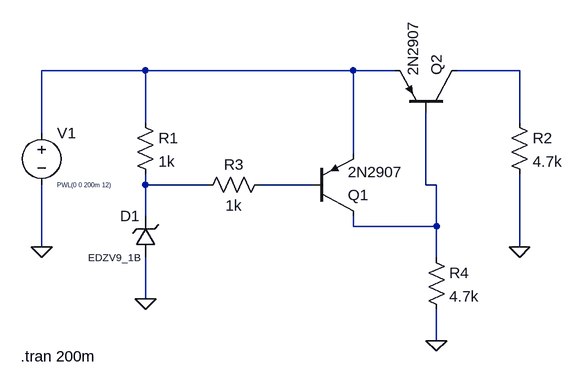
[diagram p0: schematic PNP.asc]
PNP.asc, the LTspice schematic file:
Version 4.1
SHEET 1 880 680
WIRE -32 48 -192 48
WIRE 288 48 -32 48
WIRE 352 48 288 48
WIRE 544 48 448 48
WIRE -32 128 -32 48
WIRE 544 128 544 48
WIRE -192 144 -192 48
WIRE 288 176 288 48
WIRE -32 224 -32 208
WIRE 64 224 -32 224
WIRE 224 224 144 224
WIRE 400 224 400 112
WIRE 416 224 400 224
WIRE -32 272 -32 224
WIRE 288 288 288 272
WIRE 416 288 416 224
WIRE 416 288 288 288
WIRE -192 320 -192 224
WIRE 544 320 544 208
WIRE 416 336 416 288
WIRE -32 400 -32 336
WIRE 416 464 416 416
FLAG -192 320 0
FLAG 544 320 0
FLAG 416 464 0
FLAG -32 400 0
SYMBOL voltage -192 128 R0
WINDOW 3 24 96 Left 0
WINDOW 123 0 0 Left 0
WINDOW 39 0 0 Left 0
SYMATTR Value PWL(0 0 200m 12)
SYMATTR InstName V1
SYMBOL res -48 112 R0
SYMATTR InstName R1
SYMATTR Value 1k
SYMBOL res 528 112 R0
SYMATTR InstName R2
SYMATTR Value 4.7k
SYMBOL res 160 208 R90
WINDOW 0 0 56 VBottom 2
WINDOW 3 32 56 VTop 2
SYMATTR InstName R3
SYMATTR Value 1k
SYMBOL pnp 224 272 M180
SYMATTR InstName Q1
SYMATTR Value 2N2907
SYMBOL pnp 448 112 M270
SYMATTR InstName Q2
SYMATTR Value 2N2907
SYMBOL res 400 320 R0
SYMATTR InstName R4
SYMATTR Value 4.7k
SYMBOL zener -16 336 R180
WINDOW 0 24 64 Left 2
WINDOW 3 24 0 Left 1
SYMATTR InstName D1
SYMATTR Value EDZV9_1B
TEXT -224 488 Left 2 !.tran 200m

The netlist it stands for:
* PNP.asc
V1 N001 0 PWL(0 0 200m 12)
R1 N001 N003 1k
R2 N002 0 4.7k
R3 N004 N003 1k
Q1 N005 N004 N001 0 2N2907
Q2 N002 N005 N001 0 2N2907
R4 N005 0 4.7k
D1 0 N003 EDZV9_1B
.model D D
.lib standard.dio
.model NPN NPN
.model PNP PNP
.lib standard.bjt
.tran 200m
.backanno
.end